# EAGLE design poeli (EAGLE 6.1)
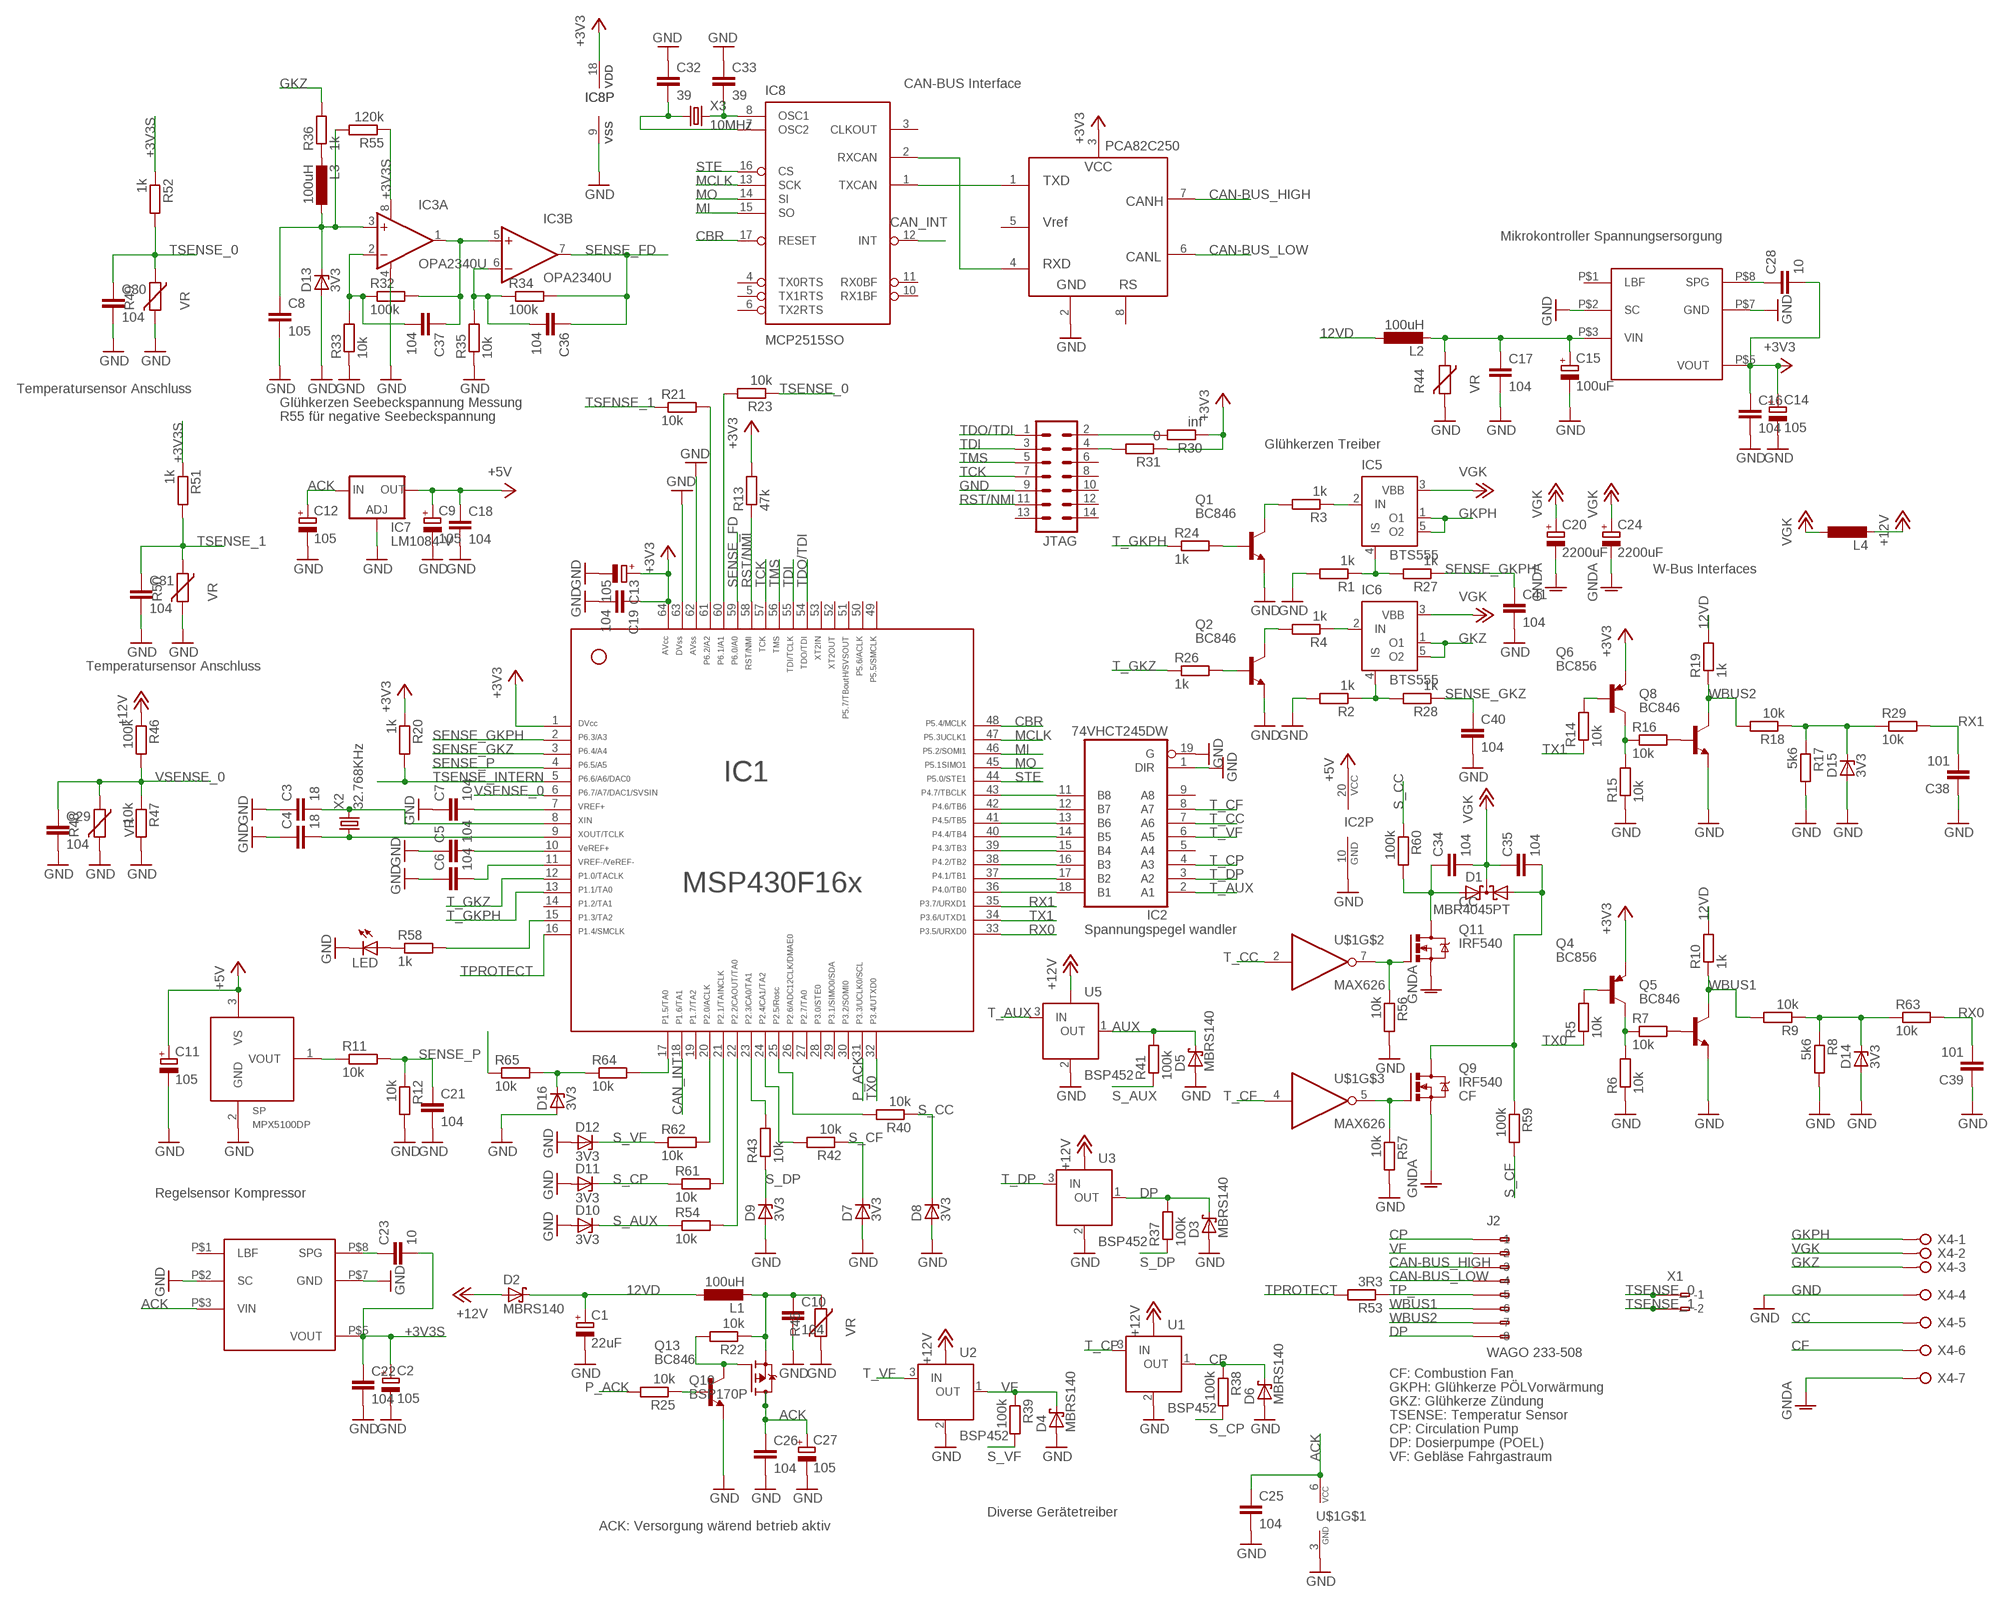
[diagram p0: schematic, sheet 1]

## Parts
C1  22uF  CPOL-EUC  [PANASONIC_C]
C2  105  CPOL-EUUD-4X5,8  [UD-4X5,8_NICHICON]
C3  18  C-EUC0603  [C0603]
C4  18  C-EUC0603  [C0603]
C5  104  C-EUC0603  [C0603]
C6  104  C-EUC0603  [C0603]
C7  104  C-EUC0603  [C0603]
C8  105  C-EUC1206  [C1206]
C9  105  CPOL-EUUD-4X5,8  [UD-4X5,8_NICHICON]
C10  104  C-EUC1206  [C1206]
C11  105  CPOL-EUUD-4X5,8  [UD-4X5,8_NICHICON]
C12  105  CPOL-EUUD-4X5,8  [UD-4X5,8_NICHICON]
C13  105  CPOL-EUUD-4X5,8  [UD-4X5,8_NICHICON]
C14  105  CPOL-EUUD-4X5,8  [UD-4X5,8_NICHICON]
C15  100uF  CPOL-EUUD-6,3X7,7  [UD-6,3X7,7_NICHICON]
C16  104  C-EUC0805K  [C0805K]
C17  104  C-EUC0805K  [C0805K]
C18  104  C-EUC1206  [C1206]
C19  104  C-EUC1206  [C1206]
C20  2200uF  CPOL-EUSANYO_G  [SANYO-OSCON_G]
C21  104  C-EUC0805K  [C0805K]
C22  104  C-EUC0603K  [C0603K]
C23  10  C-EUC0603  [C0603]
C24  2200uF  CPOL-EUSANYO_G  [SANYO-OSCON_G]
C25  104  C-EUC0805  [C0805]
C26  104  C-EUC1206  [C1206]
C27  105  CPOL-EUUD-4X5,8  [UD-4X5,8_NICHICON]
C28  10  C-EUC0603  [C0603]
C29  104  C-EUC0805K  [C0805K]
C30  104  C-EUC0805K  [C0805K]
C31  104  C-EUC0805K  [C0805K]
C32  39  C-EUC0603  [C0603]
C33  39  C-EUC0603  [C0603]
C34  104  C-EUC1206  [C1206]
C35  104  C-EUC1206  [C1206]
C36  104  C-EUC0603  [C0603]
C37  104  C-EUC0603  [C0603]
C38  101  C-EUC0402  [C0402]
C39  101  C-EUC0402  [C0402]
C40  104  C-EUC0603  [C0603]
C41  104  C-EUC0603  [C0603]
D1  MBR4045PT  DIODE_2SCHOTTKY-SOT93V  [SOT93S]
D2  MBRS140  MBRS130LT3  [SMB]
D3  MBRS140  MBRS130LT3  [SMB]
D4  MBRS140  MBRS130LT3  [SMB]
D5  MBRS140  MBRS130LT3  [SMB]
D6  MBRS140  MBRS130LT3  [SMB]
D7  3V3  ZENER-DIODESOD80C  [SOD80C]
D8  3V3  ZENER-DIODESOD80C  [SOD80C]
D9  3V3  ZENER-DIODESOD80C  [SOD80C]
D10  3V3  ZENER-DIODESOD80C  [SOD80C]
D11  3V3  ZENER-DIODESOD80C  [SOD80C]
D12  3V3  ZENER-DIODESOD80C  [SOD80C]
D13  3V3  ZENER-DIODESOD80C  [SOD80C]
D14  3V3  ZENER-DIODESOD80C  [SOD80C]
D15  3V3  ZENER-DIODESOD80C  [SOD80C]
D16  3V3  ZENER-DIODESOD80C  [SOD80C]
IC1  F169  F16X---PM64  [PM/PAG64]
IC2  74VHCT245DW  74LS245DW  [SO20W]
IC3  OPA2340U  [SO08]
IC4  ZLDO330  [SM08]
IC5  BTS555  [TO220-51]
IC6  BTS555  [TO220-51]
IC7  LM1084-V  [317TS]
IC8  MCP2515SO  MCP2510SO  [SO-18W]
IC9  PAC82C250  [PAC82C250]
IC10  ZLDO330  [SM08]
J2  WAGO 233-508  233-508  [233-508]
JTAG  MA07-2  [MA07-2]
L1  100uH  L-EUPIS2816  [PIS2816]
L2  100uH  L-EUL2825P  [L2825P]
L3  100uH  L-EUL2825P  [L2825P]
L4  L-EUL1812  [L1812]
LED  LEDCHIP-LED0603  [CHIP-LED0603]
Q1  BC846  BC846ALT1SMD  [SOT23]
Q2  BC846  BC846ALT1SMD  [SOT23]
Q4  BC856  BC856ALT1SMD  [SOT23-BEC]
Q5  BC846  BC846ALT1SMD  [SOT23]
Q6  BC856  BC856ALT1SMD  [SOT23-BEC]
Q8  BC846  BC846ALT1SMD  [SOT23]
Q9  IRF540  [TO220BV]
Q10  BSP170P  [SOT223]
Q11  IRF540  [TO220BV]
Q13  BC846  BC846ALT1SMD  [SOT23]
R1  1k  R-EU_R0603  [R0603]
R2  1k  R-EU_R0603  [R0603]
R3  1k  R-EU_R0603  [R0603]
R4  1k  R-EU_R0603  [R0603]
R5  10k  R-EU_R0603  [R0603]
R6  10k  R-EU_R0603  [R0603]
R7  10k  R-EU_R0603  [R0603]
R8  5k6  R-EU_R0603  [R0603]
R9  10k  R-EU_R0603  [R0603]
R10  1k  R-EU_R0603  [R0603]
R11  10k  R-EU_R0603  [R0603]
R12  10k  R-EU_R0603  [R0603]
R13  47k  R-EU_R0603  [R0603]
R14  10k  R-EU_R0603  [R0603]
R15  10k  R-EU_R0603  [R0603]
R16  10k  R-EU_R0603  [R0603]
R17  5k6  R-EU_R0603  [R0603]
R18  10k  R-EU_R0603  [R0603]
R19  1k  R-EU_R0603  [R0603]
R20  1k  R-EU_R0603  [R0603]
R21  10k  R-EU_R0603  [R0603]
R22  10k  R-EU_R0805  [R0805]
R23  10k  R-EU_R0603  [R0603]
R24  1k  R-EU_R0603  [R0603]
R25  10k  R-EU_R0603  [R0603]
R26  1k  R-EU_R0603  [R0603]
R27  1k  R-EU_R0603  [R0603]
R28  1k  R-EU_R0603  [R0603]
R29  10k  R-EU_R0603  [R0603]
R30  inf  R-EU_R0603  [R0603]
R31  0  R-EU_R0603  [R0603]
R32  100k  R-EU_R0603  [R0603]
R33  10k  R-EU_R0603  [R0603]
R34  100k  R-EU_R0603  [R0603]
R35  10k  R-EU_R0603  [R0603]
R36  1k  R-EU_R0603  [R0603]
R37  100k  R-EU_R0603  [R0603]
R38  100k  R-EU_R0603  [R0603]
R39  100k  R-EU_R0603  [R0603]
R40  10k  R-EU_R0603  [R0603]
R41  100k  R-EU_R0603  [R0603]
R42  10k  R-EU_R0603  [R0603]
R43  10k  R-EU_R0603  [R0603]
R44  VR  VARISTORCN1206  [CT/CN1206]
R45  VR  VARISTORCN1206  [CT/CN1206]
R46  100k  R-EU_R0805  [R0805]
R47  10k  R-EU_R0805  [R0805]
R48  VR  VARISTORCN0603  [CT/CN0603]
R49  VR  VARISTORCN0603  [CT/CN0603]
R50  VR  VARISTORCN0603  [CT/CN0603]
R51  1k  R-EU_R0603  [R0603]
R52  1k  R-EU_R0603  [R0603]
R53  3R3  R-EU_R0805  [R0805]
R54  10k  R-EU_R0603  [R0603]
R55  120k  R-EU_R1206  [R1206]
R56  10k  R-EU_R0805  [R0805]
R57  10k  R-EU_R0805  [R0805]
R58  1k  R-EU_R0603  [R0603]
R59  100k  R-EU_R0603  [R0603]
R60  100k  R-EU_R0603  [R0603]
R61  10k  R-EU_R0603  [R0603]
R62  10k  R-EU_R0603  [R0603]
R63  10k  R-EU_R0603  [R0603]
R64  10k  R-EU_R0603  [R0603]
R65  10k  R-EU_R0603  [R0603]
SP  MPX5100DP  [MPX5100DP]
U1  BSP452  [SOT223]
U2  BSP452  [SOT223]
U3  BSP452  [SOT223]
U5  BSP452  [SOT223]
U$1  MAX626  [SO08]
X1  233-502  [233-502]
X2  32.768KHz  CRYSTALTC26V  [TC26V]
X3  10MHz  CRYSTALCTS406  [CTS406]
X4  W237-07P  [W237-7P]

## Nets
12VD [GK]: C1.+ D2.C L1.1 L2.1 R10.2 R19.2
+3V3: C13.+ C14.+ C16.1 C19.1 C28.2 IC1.1 IC1.64 IC8.18(VDD) IC9.3(VCC) IC10.P$5(VOUT) Q4.E Q6.E R13.2 R20.1 R30.1 R31.1
+3V3S: C2.+ C22.1 C23.2 IC3.8(A:V+) IC4.P$5(VOUT) R51.1 R52.1 R55.1
+5V: C9.+ C11.+ C18.1 IC2.20(VCC) IC7.2(OUT) SP.3(VS)
+12V [GK]: D2.A L4.1 L4.2 R46.1 U1.4(VBB) U2.4(VBB) U3.4(VBB) U5.4(VBB) ; supply symbol labelled VGK
ACK [ACT]: C12.+ C25.1 C26.1 C27.+ IC4.P$3(VIN) IC7.3(IN) Q10.2(D) Q10.4(D1) U$1.6(VCC)
AUX: D5.C R41.2 U5.1(OUT)
CAF_RPS_INPUT: R65.1
CAN-BUS_HIGH: IC9.7(CANH) J2.A3(-3)
CAN-BUS_LOW: IC9.6(CANL) J2.A4(-4)
CAN_INT: IC1.18 IC8.12(INT)
CBR: IC1.48 IC8.17(RESET)
CC: C34.1 D1.A2 Q11.D R60.2 X4.5
CF: C35.2 D1.A1 Q9.D R59.1 X4.6
CP: D6.C J2.A1(-1) R38.1 U1.1(OUT)
DP [ACT]: D3.C J2.A8(-8) R37.2 U3.1(OUT)
GKPH [GK]: IC5.1(O1) IC5.5(O2) X4.1
GKZ [GK]: IC6.1(O1) IC6.5(O2) R36.2 X4.3
GND [GK]: C1.- C2.- C3.1 C4.1 C5.1 C6.1 C7.1 C8.2 C9.- C10.2 C11.- C12.- C13.- C14.- C15.- C16.2 C17.2 C18.2 C19.2 C21.2 C22.2 C25.2 C26.2 C27.- C29.2 C30.2 C31.2 C32.1 C33.1 C38.1 C39.1 C40.2 C41.2 D3.A D4.A D5.A D6.A D7.A D8.A D9.A D10.A D11.A D12.A D13.A D14.A D15.A D16.A IC1.62 IC1.63 IC2.1(DIR) IC2.10(GND) IC2.19(G) IC3.4(A:V-) IC4.P$2(SC) IC4.P$7(GND) IC7.1(ADJ) IC8.9(VSS) IC9.2(GND) IC10.P$2(SC) IC10.P$7(GND) JTAG.9 LED.C Q1.2(E) Q2.2(E) Q5.2(E) Q8.2(E) Q13.2(E) R1.2 R2.2 R6.1 R8.2 R12.2 R15.1 R17.2 R33.1 R35.1 R44.2 R45.2 R47.2 R48.2 R49.2 R50.2 R56.2 R57.2 SP.2(GND) U1.2(GND) U2.2(GND) U3.2(GND) U5.2(GND) U$1.3(GND) X4.4
GNDA [GK]: C20.- C24.- Q9.S Q11.S X4.7
MCLK: IC1.47 IC8.13(SCK)
MI: IC1.46 IC8.15(SO)
MO: IC1.45 IC8.14(SI)
N$1: IC8.1(TXCAN) IC9.1(TXD)
N$2: IC6.4(IS) R2.1 R28.2
N$3: Q1.3(C) R3.2
N$4: Q2.3(C) R4.2
N$5: IC1.43 IC2.11(B8)
N$6: IC5.2(IN) R3.1
N$7: C4.2 IC1.9 X2.1
N$8: JTAG.2 R30.2
N$9: JTAG.4 R31.2
N$10: IC5.4(IS) R1.1 R27.2
N$11: IC1.42 IC2.12(B7)
N$12: IC1.41 IC2.13(B6)
N$13: IC1.40 IC2.14(B5)
N$14: Q2.1(B) R26.2
N$15: IC6.2(IN) R4.1
N$16: Q1.1(B) R24.2
N$17: Q4.B R5.2
N$18: R11.1 SP.1(VOUT)
N$19: Q4.C R6.2 R7.1
N$20: Q5.1(B) R7.2
N$21: C23.1 IC4.P$8(SPG)
N$22: D14.C R8.1 R9.1 R63.1
N$23: IC1.39 IC2.15(B4)
N$24: IC1.38 IC2.16(B3)
N$25: LED.A R58.1
N$26: C3.2 IC1.8 X2.2
N$27: Q6.B R14.2
N$28: Q6.C R15.2 R16.1
N$29: C5.2 IC1.10
N$30: C6.2 IC1.11
N$31: C7.2 IC1.7
N$32: IC1.17 R64.2
N$33: Q8.1(B) R16.2
N$34: IC1.37 IC2.17(B2)
N$35: C36.2 IC3.6(B:-IN) R34.1 R35.2
N$36: IC1.36 IC2.18(B1)
N$37: Q11.G R56.1 U$1.7(O)
N$38: Q9.G R57.1 U$1.5(O)
N$39: Q13.1(B) R25.1
N$40: C37.2 IC3.2(A:-IN) R32.1 R33.2
N$41: C8.1 D13.C IC3.3(A:+IN) L3.1 R55.2
N$42: Q10.1(G) Q13.3(C) R22.2
N$43: C37.1 IC3.1(A:OUT) IC3.5(B:+IN) R32.2
N$44: L3.2 R36.1
N$45: IC1.61 R21.2
N$46: IC1.60 R23.2
N$47: IC1.25 R40.2
N$48: IC8.2(RXCAN) IC9.4(RXD)
N$49: C33.2 IC8.8(OSC1) X3.3
N$50: IC1.24 R42.2
N$51: IC1.23 R43.2
N$52: IC1.22 R54.2
N$53: IC1.21 R61.2
N$54: IC1.20 R62.2
N$55: D16.C R64.1 R65.2
N$57: C28.1 IC10.P$8(SPG)
N$58: C10.1 L1.2 Q10.3(S) R22.1 R45.1
N$59: C15.+ C17.1 IC10.P$3(VIN) L2.2 R44.1
N$60: C32.2 IC8.7(OSC2) X3.1
N$69: IC1.15 R58.2
NET$22: D15.C R17.1 R18.1 R29.1
P_ACK: IC1.31 R25.2
RST/NMI: IC1.58 JTAG.11 R13.1
RX0: C39.2 IC1.33 R63.2
RX1: C38.2 IC1.35 R29.2
S_AUX: D10.C R41.1 R54.1
S_CC: D8.C R40.1 R60.1
S_CF: D7.C R42.1 R59.2
S_CP: D11.C R38.2 R61.1
S_DP: D9.C R37.1 R43.1
S_VF: D12.C R39.2 R62.1
SENSE_FD: C36.1 IC1.59 IC3.7(B:OUT) R34.2
SENSE_GKPH: C41.1 IC1.2 R27.1
SENSE_GKZ: C40.1 IC1.3 R28.1
SENSE_P: C21.1 IC1.4 R11.2 R12.1
STE: IC1.44 IC8.16(CS)
T_AUX: IC2.2(A1) U5.3(IN)
T_CC: IC2.7(A6) U$1.2(I)
T_CF: IC2.8(A7) U$1.4(I)
T_CP: IC2.4(A3) U1.3(IN)
T_DP: IC2.3(A2) U3.3(IN)
T_GKPH: IC1.13 R24.1
T_GKZ: IC1.12 R26.1
T_VF: IC2.6(A5) U2.3(IN)
TCK: IC1.57 JTAG.7
TDI: IC1.55 JTAG.3
TDO/TDI: IC1.54 JTAG.1
TMS: IC1.56 JTAG.5
TP_: J2.A5(-5) R53.1
TPROTECT: IC1.16 R53.2
TSENSE_0: C30.1 R23.1 R49.1 R52.2 X1.A1(-1) X1.B1(B-1)
TSENSE_1: C31.1 R21.1 R50.1 R51.2 X1.A2(-2) X1.B2(B-2)
TSENSE_INTERN: IC1.5 R20.2
TX0: IC1.32 R5.1
TX1: IC1.34 R14.1
VF [ACT]: D4.C J2.A2(-2) R39.1 U2.1(OUT)
VGK [GK]: C20.+ C24.+ C34.2 C35.1 D1.C IC5.3(VBB) IC6.3(VBB) X4.2
VSENSE_0: C29.1 IC1.6 R46.2 R47.1 R48.1
WBUS1: J2.A6(-6) Q5.3(C) R9.2 R10.1
WBUS2: J2.A7(-7) Q8.3(C) R18.2 R19.1
Unconnected: IC1.14 IC1.19 IC1.26 IC1.27 IC1.28 IC1.29 IC1.30 IC1.49 IC1.50 IC1.51 IC1.52 IC1.53 IC2.5(A4) IC2.9(A8) IC4.P$1(LBF) IC8.3(CLKOUT) IC8.4(TX0RTS) IC8.5(TX1RTS) IC8.6(TX2RTS) IC8.10(RX1BF) IC8.11(RX0BF) IC9.5(VREF) IC9.8(RS) IC10.P$1(LBF) J2.B1(B-1) J2.B2(B-2) J2.B3(B-3) J2.B4(B-4) J2.B5(B-5) J2.B6(B-6) J2.B7(B-7) J2.B8(B-8) JTAG.6 JTAG.8 JTAG.10 JTAG.12 JTAG.13 JTAG.14 SP.4(V1) SP.5(V2) SP.6(VEX)

## Notes on the sheet
- CAN-BUS Interface
- Mikrokontroller Spannungsersorgung
- Temperatursensor Anschluss
- Glühkerzen Seebeckspannung Messung
- R55 für negative Seebeckspannung
- Glühkerzen Treiber
- W-Bus Interfaces
- Temperatursensor Anschluss
- Spannungspegel wandler
- Regelsensor Kompressor
- CF: Combustion Fan
- GKPH: Glühkerze PÖLVorwärmung
- GKZ: Glühkerze Zündung
- TSENSE: Temperatur Sensor
- CP: Circulation Pump
- DP: Dosierpumpe (POEL)
- VF: Gebläse Fahrgastraum
- Diverse Gerätetreiber
- ACK: Versorgung wärend betrieb aktiv

## Library data of the parts
C1 C2 C9 C11-C15 C20 C24 C27 = rcl:CPOL-EU: POLARIZED CAPACITOR, European symbol
C3-C8 C10 C16-C19 C21-C23 C25 C26 C28-C41 = rcl:C-EU: CAPACITOR, European symbol
D1 = diode:DIODE_2SCHOTTKY-: Dual SCHOTTKY DIODE common cathode
D2-D6 = diode:MBRS130LT3: Schottky Power Rectifier Source: http://www.onsemi.com/pub/Collateral/MBRS130LT3-D.PDF
D7-D16 = diode:ZENER-DIODE: Z-Diode
IC1 = TI_MSP430_v13:F16X---PM64: *** MSP430F16x *** PM64
IC2 = 74xx-us:74*245: Octal BUS TRANSCEIVER, 3-state
IC3 = burr-brown:OPA2340: Single-Supply, Rail-to-Rail Operational Amplifiers MicroAmplifier(TM) Series; Product Folder:OPA2340
IC4 IC10 = misc:ZLDO330
IC5 IC6 = infineon:BTS555: PROFET® Data Sheet BTS555 Source: http://www.infineon.com/upload/Document/cmc_upload/documents/011/8726/Datasheet_BTS555.pdf
IC7 = v-reg-2:LM1084: VOLTAGE REGULATOR
IC8 = microchip_can:MCP2510
IC9 = pca82c250:PAC82C250
J2 = con-wago:233-508: WAGO Cage Clamp
JTAG = con-lstb:MA07-2: PIN HEADER
L1-L4 = rcl:L-EU: INDUCTOR, European symbol
LED = led:LED: LED OSRAM: - CHIPLED LG R971, LG N971, LY N971, LG Q971, LY Q971, LO R971, LY R971 LH N974, LH R974 LS Q976, LO Q976, LY Q976 LO Q996 - Hyper CHIPLED LW Q18S LB Q993, LB Q99A, LB R99A - SideLED LS A670, LO A670, LY A670, LG A670, LP A670 LB A673, LV A673, LT A673, LW A673 LH A674 LY A675 LS A676, LA A676, LO A676, LY A676, LW A676 LS A679, LY A679, LG A679 - Hyper Micro SIDELED® LS Y876, LA Y876, LO Y876, LY Y876 LT Y87S - SmartLED LW L88C, LW L88S LB L89C, LB L89S, LG L890 LS L89K, LO L89K, LY L89K LS L896, LA L896, LO L896, LY L896 - TOPLED LS T670, LO T670, LY T670, LG T670, LP T670 LSG T670, LSP T670, LSY T670, LOP T670, LYG T670 LG T671, LOG T671, LSG T671 LB T673, LV T673, LT T673, LW T673 LH T674 LS T676, LA T676, LO T676, LY T676, LB T676, LH T676, LSB T676, LW T676 LB T67C, LV T67C, LT T67C, LS T67K, LO T67K, LY T67K, LW E67C LS E67B, LA E67B, LO E67B, LY E67B, LB E67C, LV E67C, LT E67C LW T67C LS T679, LY T679, LG T679 LS T770, LO T770, LY T770, LG T770, LP T770 LB T773, LV T773, LT T773, LW T773 LH T774 LS E675, LA E675, LY E675, LS T675 LS T776, LA T776, LO T776, LY T776, LB T776 LHGB T686 LT T68C, LB T68C - Hyper Mini TOPLED® LB M676 - Mini TOPLED Santana® LG M470 LS M47K, LO M47K, LY M47K Source: http://www.osram.convergy.de LUXEON: - LUMILED® LXK2-PW12-R00, LXK2-PW12-S00, LXK2-PW14-U00, LXK2-PW14-V00 LXK2-PM12-R00, LXK2-PM12-S00, LXK2-PM14-U00 LXK2-PE12-Q00, LXK2-PE12-R00, LXK2-PE12-S00, LXK2-PE14-T00, LXK2-PE14-U00 LXK2-PB12-K00, LXK2-PB12-L00, LXK2-PB12-M00, LXK2-PB14-N00, LXK2-PB14-P00, LXK2-PB14-Q00 LXK2-PR12-L00, LXK2-PR12-M00, LXK2-PR14-Q00, LXK2-PR14-R00 LXK2-PD12-Q00, LXK2-PD12-R00, LXK2-PD12-S00 LXK2-PH12-R00, LXK2-PH12-S00 LXK2-PL12-P00, LXK2-PL12-Q00, LXK2-PL12-R00 Source: www.luxeon.com KINGBRIGHT: KA-3528ASYC Source: www.kingbright.com
Q1 Q2 Q5 Q8 Q13 = transistor-npn:BC846*: NPN Transistor
Q4 Q6 = transistor-pnp:BC856*: PNP Transistror
Q9 Q11 = transistor-power:IRF540: HEXFET Power MOSFET
Q10 = transistor-fet:BSP170P: SIPMOS(R) Small-Signal-Transistor P-Channel, Enhancement mode Source: http://www.infineon.com/upload/Document/BSP170P_Rev2.4.pdf
R1-R43 R46 R47 R51-R65 = rcl:R-EU_: RESISTOR, European symbol
R44 R45 R48-R50 = varistor:VARISTOR: VARISTOR
SP = mpx4100a:MPX5100: Freescale Pressure sensor
U1-U3 U5 = infineon:BSP452
U$1 = maxim:MAX626: Dual MOS-FET inverting driver
X1 = con-wago:233-502: WAGO Cage Clamp; MPN: 233-502; OC_FARNELL: 1777096; OC_NEWARK: 58M2630
X2 X3 = crystal:CRYSTAL: CRYSTAL
X4 = con-wago-508:W237-07P: WAGO SREW CLAMP; OC_FARNELL: unknown; OC_NEWARK: unknown

## Net classes
1 GK: width 1.27 mm, clearance 0.254 mm
2 ACT: width 0.61 mm, clearance 0.254 mm

## Board
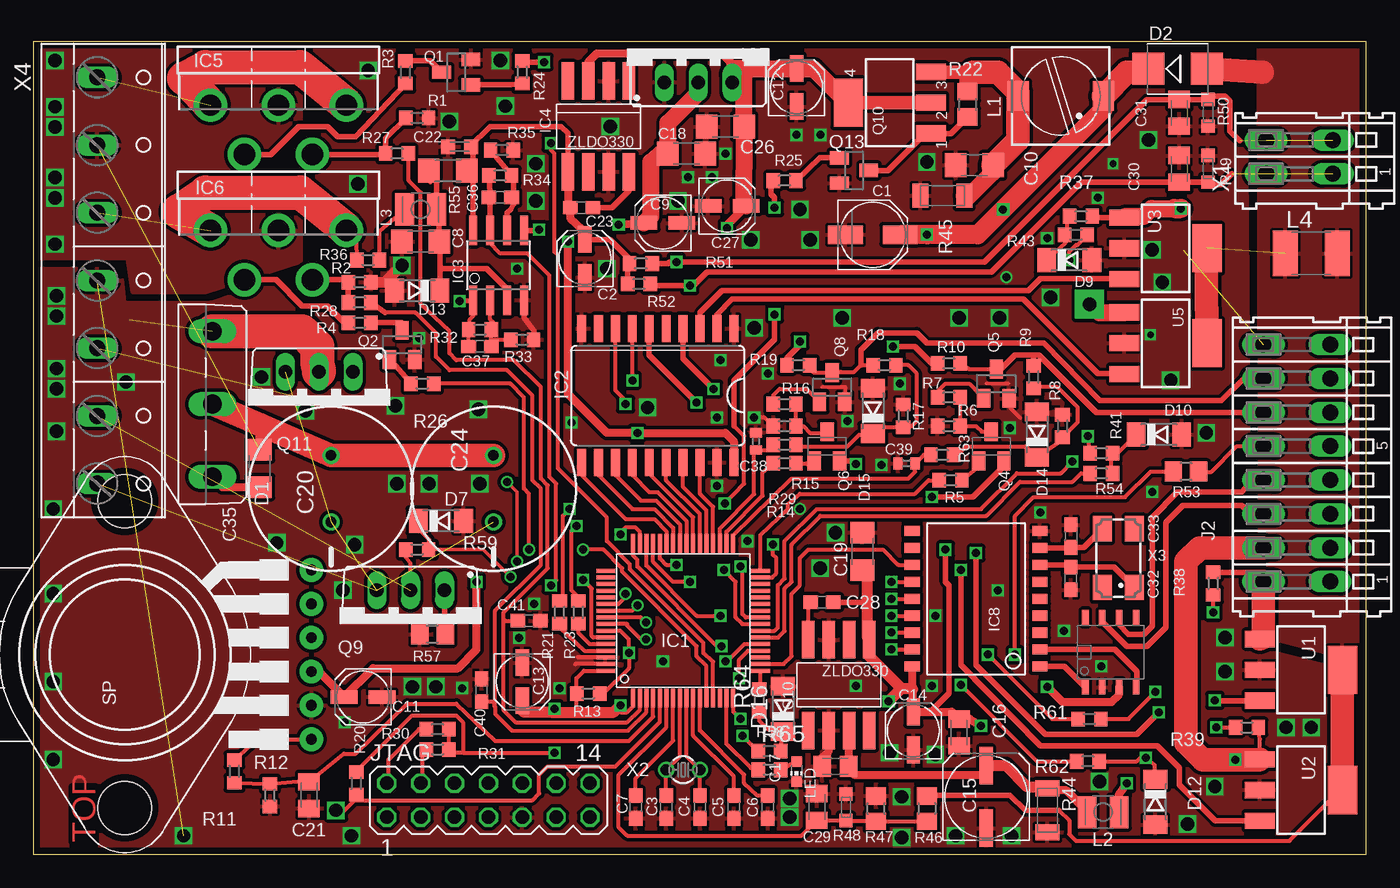
[diagram p1: board, top side]
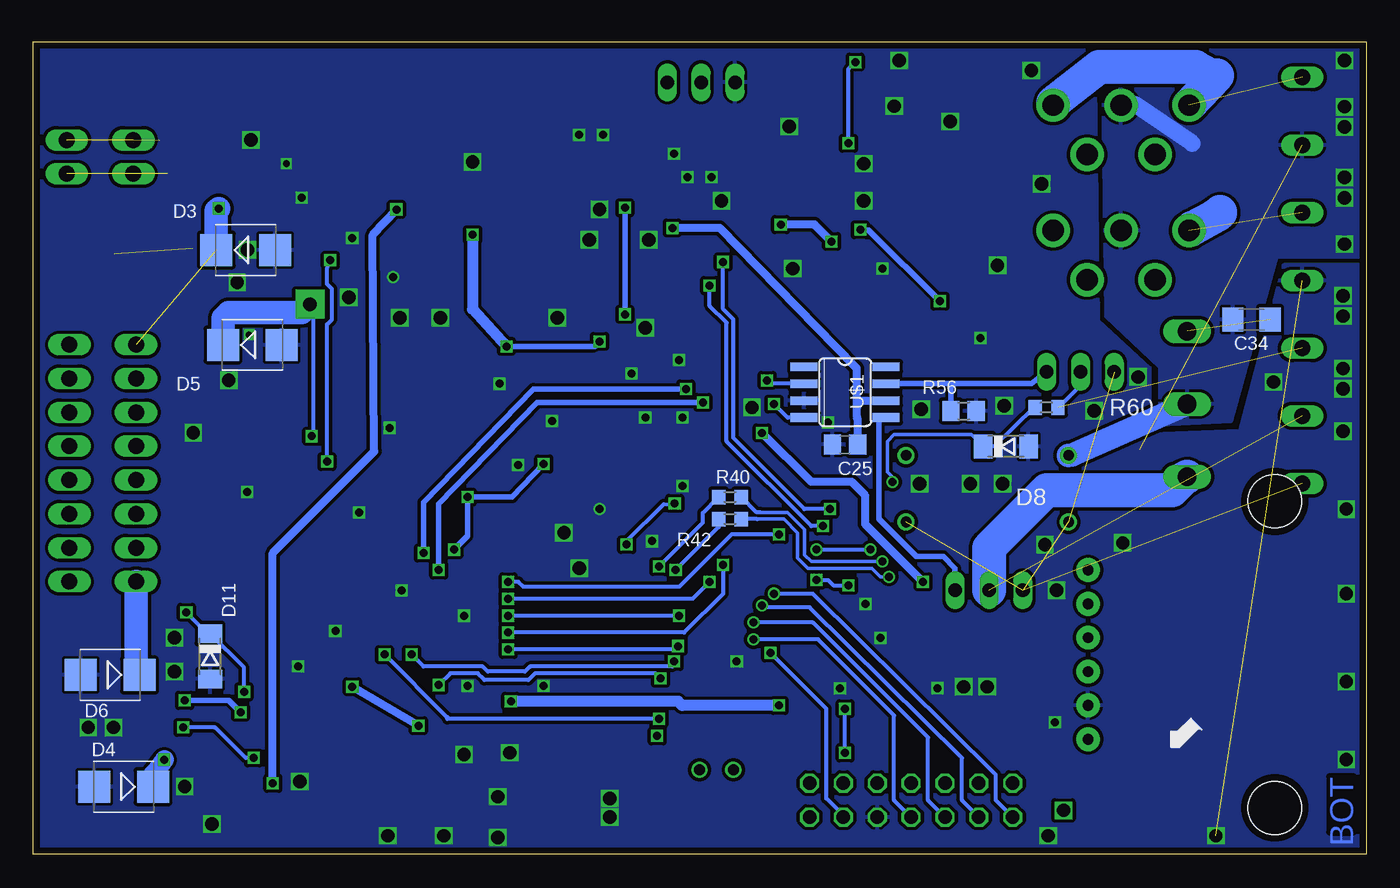
[diagram p2: board, bottom side, seen from below]

Size 99.97 x 60.95 mm. Coordinates in mm from the lower left corner, seen from the top.
Outline: 0,0 99.97,0 99.97,60.95 0,60.95 0,0
Copper layers (1*16): Top 0.035mm / dielectric 1.5mm / Bottom 0.035mm
Design rules: minimum track width 8mil, minimum drill 0.3mm, track to track 8mil, track to pad 8mil, pad to pad 8mil, via to via 8mil, smd to smd 8mil, copper to edge 20mil, drill to drill 10mil, minimum pad ring 8mil, minimum via ring 6mil, stop-mask expansion 3mil, vias tented up to drill 0mil, thermal gap 8mil

### Footprints (pad centres in the part's own frame; a part is rotated, then mirrored left to right if it is on the bottom)
PANASONIC_C = smd 2.6 x 1.4: + 2.05,0; - -2.05,0
UD-4X5,8_NICHICON = smd 2 x 1: + 1.425,0; - -1.425,0
C0603 = smd 1.1 x 1: 1 -0.85,0; 2 0.85,0
C1206 = smd 1.6 x 1.8: 1 -1.4,0; 2 1.4,0
UD-6,3X7,7_NICHICON = smd 2.8 x 1: + 2.35,0; - -2.35,0
C0805K = smd 1.3 x 1.6: 1 -1,0; 2 1,0
SANYO-OSCON_G = drill 0.8 pad 1.27: + 2.5,0; - -2.5,0
C0603K = smd 1.05 x 1.08: 1 -0.875,0; 2 0.875,0
C0805 = smd 1.3 x 1.5: 1 -0.95,0; 2 0.95,0
C0402 = smd 0.7 x 0.9: 1 -0.65,0; 2 0.65,0
SOT93S = drill 1.397 long: A1 -5.461,-2.54; A2 5.461,-2.54; C 0,-2.54
SMB = smd 2.4 x 2.4: A 2.2,0; C -2.2,0
SOD80C = smd 1.4 x 1.8: A 1.7,0; C -1.7,0
PM/PAG64 = smd 1.4 x 0.3: 1 -5.8,3.75; 2 -5.8,3.25; 3 -5.8,2.75; 4 -5.8,2.25; 5 -5.8,1.75; 6 -5.8,1.25; 7 -5.8,0.75; 8 -5.8,0.25; 9 -5.8,-0.25; 10 -5.8,-0.75; 11 -5.8,-1.25; 12 -5.8,-1.75; 13 -5.8,-2.25; 14 -5.8,-2.75; 15 -5.8,-3.25; 16 -5.8,-3.75; 33 5.8,-3.75; 34 5.8,-3.25; 35 5.8,-2.75; 36 5.8,-2.25; 37 5.8,-1.75; 38 5.8,-1.25; 39 5.8,-0.75; 40 5.8,-0.25; 41 5.8,0.25; 42 5.8,0.75; 43 5.8,1.25; 44 5.8,1.75; 45 5.8,2.25; 46 5.8,2.75; 47 5.8,3.25; 48 5.8,3.75 | smd 0.3 x 1.4: 17 -3.75,-5.8; 18 -3.25,-5.8; 19 -2.75,-5.8; 20 -2.25,-5.8; 21 -1.75,-5.8; 22 -1.25,-5.8; 23 -0.75,-5.8; 24 -0.25,-5.8; 25 0.25,-5.8; 26 0.75,-5.8; 27 1.25,-5.8; 28 1.75,-5.8; 29 2.25,-5.8; 30 2.75,-5.8; 31 3.25,-5.8; 32 3.75,-5.8; 49 3.75,5.8; 50 3.25,5.8; 51 2.75,5.8; 52 2.25,5.8; 53 1.75,5.8; 54 1.25,5.8; 55 0.75,5.8; 56 0.25,5.8; 57 -0.25,5.8; 58 -0.75,5.8; 59 -1.25,5.8; 60 -1.75,5.8; 61 -2.25,5.8; 62 -2.75,5.8; 63 -3.25,5.8; 64 -3.75,5.8
SO20W = smd 0.66 x 2.032: 1 -5.715,-5.029; 2 -4.445,-5.029; 3 -3.175,-5.029; 4 -1.905,-5.029; 5 -0.635,-5.029; 6 0.635,-5.029; 7 1.905,-5.029; 8 3.175,-5.029; 9 4.445,-5.029; 10 5.715,-5.029; 11 5.715,5.029; 12 4.445,5.029; 13 3.175,5.029; 14 1.905,5.029; 15 0.635,5.029; 16 -0.635,5.029; 17 -1.905,5.029; 18 -3.175,5.029; 19 -4.445,5.029; 20 -5.715,5.029
SO08 = smd 0.61 x 2.21: 1 -1.905,-2.616; 2 -0.635,-2.616; 3 0.635,-2.616; 4 1.905,-2.616; 5 1.905,2.616; 6 0.635,2.616; 7 -0.635,2.616; 8 -1.905,2.616
SM08 = smd 0.94 x 2.794: P$1 -2.286,-3.404; P$2 -0.762,-3.404; P$3 0.762,-3.404; P$4 2.286,-3.404; P$5 2.286,3.404; P$6 0.762,3.404; P$7 -0.762,3.404; P$8 -2.286,3.404
TO220-51 = drill 1.6 pad 2.5: 1 -5.1,-4.5; 2 -2.55,-8.2; 3 0,-4.5; 4 2.55,-8.2; 5 5.1,-4.5
317TS = drill 1.016 long: 1 -2.54,-2.54; 2 0,-2.54; 3 2.54,-2.54
SO-18W = smd 0.762 x 1.143: 1 -5.08,-4.788; 2 -3.81,-4.788; 3 -2.54,-4.788; 4 -1.27,-4.788; 5 0,-4.788; 6 1.27,-4.788; 7 2.54,-4.788; 8 3.81,-4.788; 9 5.08,-4.788; 10 5.08,4.788; 11 3.81,4.788; 12 2.54,4.788; 13 1.27,4.788; 14 0,4.788; 15 -1.27,4.788; 16 -2.54,4.788; 17 -3.81,4.788; 18 -5.08,4.788
PAC82C250 = smd 0.5 x 1.1: 1 -1.71,-2.57; 2 -0.44,-2.57; 3 0.83,-2.57; 4 2.1,-2.57; 5 2.1,2.67; 6 0.83,2.67; 7 -0.44,2.67; 8 -1.71,2.67
233-508 = drill 1.2 long: A1 -8.89,2.5; A2 -6.35,2.5; A3 -3.81,2.5; A4 -1.27,2.5; A5 1.27,2.5; A6 3.81,2.5; A7 6.35,2.5; A8 8.89,2.5; B1 -8.89,-2.5; B2 -6.35,-2.5; B3 -3.81,-2.5; B4 -1.27,-2.5; B5 1.27,-2.5; B6 3.81,-2.5; B7 6.35,-2.5; B8 8.89,-2.5
MA07-2 = drill 1.016 octagon: 1 -7.62,-1.27; 2 -7.62,1.27; 3 -5.08,-1.27; 4 -5.08,1.27; 5 -2.54,-1.27; 6 -2.54,1.27; 7 0,-1.27; 8 0,1.27; 9 2.54,-1.27; 10 2.54,1.27; 11 5.08,-1.27; 12 5.08,1.27; 13 7.62,-1.27; 14 7.62,1.27
PIS2816 = smd 2.2 x 1.6: 1 0,3.2; 2 0,-3.2
L2825P = smd 1.4 x 2.4: 1 -1.2,0; 2 1.2,0
L1812 = smd 1.9 x 3.4: 1 -1.95,0; 2 1.95,0
CHIP-LED0603 = smd 0.8 x 0.8: A 0,-0.75; C 0,0.75
SOT23 = smd 1 x 1.4: 1 -0.95,-1.1; 2 0.95,-1.1; 3 0,1.1
SOT23-BEC = smd 1 x 1.4: B -0.95,-1.1; C 0,1.1; E 0.95,-1.1
TO220BV = drill 1.016 long: D 0,-2.54; G -2.54,-2.54; S 2.54,-2.54
SOT223 = smd 1.219 x 2.235: 1 -2.311,-3.099; 2 0,-3.099; 3 2.311,-3.099 | smd 3.6 x 2.2: 4 0,3.099
R0603 = smd 1 x 1.1: 1 -0.85,0; 2 0.85,0
R0805 = smd 1.3 x 1.5: 1 -0.95,0; 2 0.95,0
CT/CN1206 = smd 1.2 x 1.8: 1 -1.65,0; 2 1.65,0
CT/CN0603 = smd 1 x 1: 1 -1,0; 2 1,0
R1206 = smd 1.6 x 1.803: 1 -1.422,0; 2 1.422,0
MPX5100DP = drill 0.8 pad 1.778: 1 -6.35,-13.995; 2 -3.81,-14; 3 -1.27,-14; 4 1.27,-14; 5 3.81,-14; 6 6.35,-13.995 | hole 4: -11.5,0; 11.5,0
SO08' = smd 0.66 x 2.032: 1 -1.905,-3.073; 2 -0.635,-3.073; 3 0.635,-3.073; 4 1.905,-3.073; 5 1.905,3.073; 6 0.635,3.073; 7 -0.635,3.073; 8 -1.905,3.073
233-502 = drill 1.2 long: A1 -1.27,2.5; A2 1.27,2.5; B1 -1.27,-2.5; B2 1.27,-2.5
TC26V = drill 0.813: 1 -1.27,0; 2 1.27,0
CTS406 = smd 1.9 x 1.4: 1 -2.2,-1.2; 2 2.2,-1.2; 3 2.2,1.2; 4 -2.2,1.2
W237-7P = drill 1.194 long: 1 -15.24,-0.635; 2 -10.16,-0.635; 3 -5.08,-0.635; 4 0,-0.635; 5 5.08,-0.635; 6 10.16,-0.635; 7 15.24,-0.635

### Placement (x,y rotation side)
C1  62.96,46.48 0 top
C2  41.37,44.7 90 top
C3  47.47,3.56 90 top
C4  50.01,3.56 90 top
C5  52.55,3.56 90 top
C6  55.09,3.56 90 top
C7  45.18,3.56 90 top
C8  29.05,45.97 180 top
C9  47.21,47.37 180 top
C10  70.58,51.69 180 top
C11  24.73,11.81 180 top
C12  57.25,57.53 90 top
C13  36.67,12.95 270 top
C14  66.01,9.27 90 top
C15  71.47,4.32 90 top
C16  69.44,9.14 270 top
C17  60.17,6.6 180 top
C18  48.99,52.58 0 top
C19  62.2,22.73 90 top
C20  22.32,27.43 90 top
C21  20.67,4.45 270 top
C22  31.97,53.09 180 top
C23  41.12,48.51 180 top
C24  34.51,27.43 90 top
C25  39.08,30.73 180 bottom
C26  51.91,54.61 180 top
C27  52.04,48.64 0 top
C28  59.15,18.92 0 top
C29  58.77,3.56 90 top
C30  85.95,51.44 90 top
C31  85.95,55.63 270 top
C32  77.82,20.7 90 top
C33  77.82,23.88 270 top
C34  8.6,40.13 180 bottom
C35  16.99,28.96 270 top
C36  35.02,49.28 0 top
C37  33.5,38.1 0 top
C38  54.2,30.99 270 top
C39  65.5,29.34 0 top
C40  33.62,12.32 90 top
C41  37.18,17.53 0 top
D1  10.89,33.78 90 top
D2  85.82,58.93 0 top
D3  84.04,45.34 0 bottom
D4  93.19,5.08 180 bottom
D5  83.53,38.23 0 bottom
D6  94.2,13.46 180 bottom
D7  30.57,25.02 0 top
D8  27.02,30.61 0 bottom
D9  77.69,44.58 0 top
D10  84.42,31.5 0 top
D11  86.71,14.86 270 bottom
D12  84.17,3.94 270 top
D13  28.8,42.29 180 top
D14  75.28,31.5 90 top
D15  62.96,33.27 90 top
D16  56.23,10.92 90 top
IC1  48.74,17.53 90 top
IC2  46.83,34.42 180 top
IC3  34.89,44.2 0 top
IC4  42.39,54.61 180 top
IC5  18.38,60.71 0 top
IC6  18.38,51.31 0 top
IC7  49.88,60.45 0 top
IC8  70.71,19.18 90 top
IC9  80.61,15.11 0 top
IC10  60.42,12.7 0 top
J2  94.76,29.36 90 top
JTAG  34.13,4.06 0 top
L1  77.06,56.9 270 top
L2  80.23,3.17 180 top
L3  29.05,48.39 180 top
L4  95.85,45.09 0 top
LED  57.25,6.22 180 top
Q1  31.72,58.67 90 top
Q2  27.65,38.23 0 top
Q4  71.85,30.61 0 top
Q5  72.23,35.31 0 top
Q6  59.53,30.61 0 top
Q8  59.91,35.05 0 top
Q9  28.29,17.27 180 top
Q10  64.23,56.39 90 top
Q11  21.43,33.66 180 top
Q13  61.56,51.31 270 top
R1  28.8,55.24 0 top
R2  24.48,42.93 0 top
R3  27.91,58.67 90 top
R4  24.48,39.88 0 top
R5  68.8,28.07 0 top
R6  68.67,32.13 0 top
R7  68.67,34.29 180 top
R8  77.18,32.13 90 top
R9  75.03,35.81 90 top
R10  68.67,36.83 180 top
R11  15.08,6.22 270 top
R12  17.75,4.45 270 top
R13  41.62,12.06 180 top
R14  56.36,29.34 0 top
R15  56.36,32.13 0 top
R16  56.36,33.78 180 top
R17  65.25,32.89 90 top
R18  63.85,36.7 180 top
R19  57.37,36.7 180 top
R20  24.23,5.33 270 top
R21  39.47,18.16 270 top
R22  70.07,56.26 270 top
R23  40.86,18.16 270 top
R24  36.67,58.67 270 top
R25  56.36,50.55 180 top
R26  29.18,35.31 180 top
R27  27.27,52.58 180 top
R28  24.48,41.4 180 top
R29  56.36,30.73 180 top
R30  30.32,9.4 180 top
R31  30.32,7.87 180 top
R32  33.5,39.37 180 top
R33  36.67,38.61 180 top
R34  35.02,50.93 180 top
R35  35.15,52.83 180 top
R36  25.11,44.58 180 top
R37  78.58,47.88 0 top
R38  88.49,20.32 270 top
R39  91.03,9.53 180 top
R40  47.72,26.8 180 bottom
R41  80.11,30.1 180 top
R42  47.72,25.15 180 bottom
R43  78.2,46.48 0 top
R44  76.04,3.3 270 top
R45  68.17,49.4 180 top
R46  67.02,3.43 270 top
R47  63.21,3.43 90 top
R48  60.95,3.53 90 top
R49  88.11,51.44 90 top
R50  88.11,55.63 270 top
R51  45.56,44.32 0 top
R52  45.43,42.8 0 top
R53  86.46,28.72 180 top
R54  80.11,28.57 180 top
R55  31.08,51.31 180 top
R56  30.19,33.27 0 bottom
R57  29.94,16.51 180 top
R58  55.21,6.35 180 top
R59  28.8,22.86 0 top
R60  23.97,33.53 0 bottom
R61  79.22,10.16 180 top
R62  79.09,6.99 180 top
R63  68.17,29.97 180 top
R64  54.45,11.56 90 top
R65  55.21,7.75 0 top
SP  6.86,14.99 90 top
U1  95.09,13.84 270 top
U2  95.09,4.83 270 top
U3  84.93,45.47 270 top
U5  84.93,38.35 270 top
U$1  MAX626  [SO08']  39.08,34.67 270 bottom
X1  94.96,52.32 90 top
X2  48.74,6.35 180 top
X3  81.38,22.23 90 top
X4  5.43,43.05 270 top

### Tracks (layer width: path | path; a pad name or v marks a point on that pad's centre or on a via)
12VD  (via drill 0.6)
  Top 0.406: v57.5,38.48 57.5,38.23 56.52,37.25 R19.2 | R10.2 67.41,36.83 66.14,38.1 v64.48,38.1
  Top 0.61: L2.1 81.43,4.5 v82.01,5.33
  Top 1.27: 83.05,58.67 D2.C
  Top 1.422: C1.+ v67.02,46.48 70.83,46.48 v72.74,48.39 80.23,55.88 80.23,56.87 L1.1
  Top 1.778: L1.1 82.03,58.67 83.05,58.67
  Bottom 0.406: v64.48,38.1 57.88,38.1 v57.5,38.48
  Bottom 0.61: v82.01,5.33 82.01,22.61 74.39,30.23 74.52,46.48 v72.74,48.39
  Bottom 0.813: v67.02,46.48 67.02,40.89 v64.48,38.1
+3V3  (via drill 0.6)
  Top 0.305: Q6.E 60.74,29.16 | IC1.64 41.3,13.78 40.74,13.21 40.74,12.1 | 40.74,12.1 R13.2 | IC1.1 44.99,11.11 44.55,10.67 44.04,10.67 43.78,10.92 | 40.74,10.67 40.74,12.1 | 60.04,18.88 C28.2 | v39.08,10.92 38.83,10.67 | 32.23,7.62 31.43,7.62 R31.1 R30.1 31.21,9.69 | 32.23,7.62 v39.08,7.62 | R20.1 24.23,6.22 28.42,10.41 31.72,10.41 32.23,9.91 32.23,7.62
  Top 0.406: v67.41,26.8 70.45,26.8 72.99,29.34 72.82,29.51 Q4.E | v68.42,22.86 68.42,20.45 68.67,20.19 68.67,12.06 67.41,10.79 67.41,10.82 67.28,10.7 | Q6.E 61.47,29.51 v61.69,29.29 | 60.04,18.88 62.49,18.88 62.49,18.96 62.58,19.05 | IC10.P$5 62.58,16.23
  Top 0.61: v71.09,9.65 70.22,10.18 69.47,10.18 C16.1 68.89,10.7 67.28,10.7 C14.+ | IC9.3 81.44,12.01 80.87,11.43 77.18,11.43 v76.04,12.57 | C14.+ 65.85,10.29 | IC8.18 65.92,12.32 65.92,10.79 C14.+
  Top 0.813: v44.04,11.18 43.78,10.92 43.53,10.67 40.74,10.67 38.83,10.67 36.8,10.67 36.7,10.77 C13.+ | IC10.P$5 62.71,14.86 65.12,12.45 | 65.12,12.45 65.92,12.45 65.92,12.32 | v64.15,11.48 65.12,12.45 | 62.58,16.23 62.58,19.05 62.58,20.95 C19.1
  Bottom 0.305: v39.08,7.62 v39.08,10.92
  Bottom 0.406: v68.42,22.86 67.41,23.88 v67.41,26.8 64.05,26.8 v61.69,29.29
  Bottom 0.61: v71.09,9.65 v76.04,12.57
  Bottom 0.813: v44.04,11.18 51.3,11.18 51.61,11.48 v64.15,11.48
+3V3S
  Top 0.406: IC4.P$5 40.1,54.1 39.59,54.61 34.26,54.61 32.73,53.09 C22.1 32.99,52.95 32.99,51.31 | R52.1 44.58,44.2 R51.1 44.58,44.45 44.67,44.7 43.25,46.13 C2.+ | 32.99,51.31 R55.1 | IC3.8 32.99,51.31
  Top 0.61: C2.+ 41.62,46.48 40.27,47.74 C23.2 40.1,48.43 IC4.P$5
+5V  (via drill 0.6)
  Top 0.61: IC2.20 52.55,30.99 51.91,31.62 v45.31,31.62 43.02,31.62 40.1,34.54 v40.1,45.97 | v43.91,47.24 44.16,47.27 C9.+ | SP.3 21.4,13.72 C11.+ 25.47,13.97 31.84,13.97 33.24,15.37 v33.24,20.45
  Top 1.27: C9.+ 46.32,47.88 46.32,51.94 47.31,52.81 C18.1 47.59,53.34 47.59,54.86 49.88,57.15 IC7.2
  Bottom 0.61: v40.1,45.97 41.37,47.24 v43.91,47.24 | v45.31,31.62 41.62,27.94 38.58,27.94 37.56,26.92 37.56,24.77 v33.24,20.45
+12V  (1 unrouted)
  Top 0.305: 76.93,3.3 77.69,2.54 77.69,1.52 78.2,1.02 94.2,1.02 98.01,4.83 U2.4
  Top 0.406: 67.09,4.45 73.25,4.45 74.39,3.3 76.93,3.3
  Top 0.813: R46.1 67.09,4.45
  Top 1.778: U2.4 U1.4 | 87.98,41.02 88.03,40.84 | 87.98,41.02 87.98,45.16 U3.4 | U5.4 88.03,40.84 87.98,41.02 | D2.A 92.19,58.67
  pour Top: 91.92,60.83 99.54,60.83 99.79,14.35 92.04,16.38
ACK  (via drill 0.6)
  Top 0.61: IC4.P$3 41.62,59.44 42.26,60.07 51.66,60.07 52.29,59.44 52.29,58.55 | v52.04,46.99 52.04,47.22 C27.+
  Top 1.016: Q10.4 Q10.2
  Top 1.27: Q10.4 61.06,56.39 58.52,58.93 55.75,58.93 C12.+ 53.18,58.96 | 53.18,58.96 52.7,58.96 52.29,58.55 IC7.3 | 53.18,58.96 53.31,58.83 C26.1 53.34,53.57 53.31,49.15 C27.+
  Bottom 0.61: v52.04,46.99 48.48,46.99 38.32,36.58 38.2,36.45 38.2,32.89 38.18,32.79 | C25.1 38.13,32.58 38.18,32.79 | U$1.6 38.15,34.04 38.18,32.79
AUX  (via drill 0.6, 1 pad 2.18)
  Top 0.305: 81.81,40.64 U5.1 | R41.2 79.13,31.33 v79.09,31.37
  Top 1.27: v79.22,41.27 79.34,41.27 79.98,40.64 81.81,40.64
  Bottom 0.305: v79.09,31.37 78.96,31.5 78.96,41.15 v79.22,41.27
  Bottom 1.778: D5.C 85.73,40.22 85.31,40.64 79.85,40.64 v79.22,41.27
CAF_RPS_INPUT  (via drill 0.6)
  Top 0.305: R65.1 54.2,7.87 v53.18,8.89
CAN-BUS_HIGH
  Top 0.406: IC9.7 80.17,17.46 82.01,15.62 83.53,15.62 84.93,17.02 84.93,24.89 86.2,26.16 90.65,26.16 91.28,25.53 92.24,25.53 J2.A3
CAN-BUS_LOW
  Top 0.406: IC9.6 81.44,17.2 82.14,16.51 83.28,16.51 83.92,17.14 83.92,25.27 85.82,27.18 90.65,27.18 91.41,28.07 92.24,28.07 J2.A4
CAN_INT
  Top 0.305: IC1.18 56.28,14.28 56.86,14.86 56.86,19.56 57.5,20.19 57.5,22.23 58.13,22.86 63.72,22.86 64.87,21.72 IC8.12
CBR  (via drill 0.6)
  Top 0.305: v51.61,15.62 51.28,15.62 45.31,21.59 45.31,22.1 44.99,22.42 IC1.48 | v64.36,15.37 IC8.17
  Bottom 0.305: v51.61,15.62 51.66,15.62 51.91,15.37 v64.36,15.37
CC  (2 unrouted)
  Top 2.54: D1.A2 20.16,39.24 21.3,38.1 21.3,36.83 Q11.D
  Bottom 0.305: R60.2 23.08,33.53 21.43,35.18 Q11.D
CF  (1 unrouted)
  Top 0.305: R59.1 27.95,22.31 28.29,21.84 Q9.D
  Top 0.61: C35.2 14.2,27.56 D1.A1
  Bottom 2.54: D1.A1 13.68,28.19 14.57,27.3 23.97,27.3 28.29,22.99 Q9.D
CP
  Top 0.406: R38.1 92.3,21.17 92.26,20.45
  Top 1.778: J2.A1 92.26,20.45 92.26,16.29 U1.1
  Bottom 1.778: D6.C 92.26,13.97 J2.A1
DP  (via drill 0.6)  (1 unrouted)
  Top 0.406: U3.1 79.2,47.78 R37.2
  Top 1.27: 85.57,48.46 83.86,48.46 83.28,47.88 81.93,47.88 U3.1
  Top 1.422: 85.57,48.46 v86.07,48.46
  Bottom 1.778: D3.C 86.24,48.29 v86.07,48.46
GKPH  (1 unrouted)
  Top 1.778: 11.68,57.94 11.3,58.19 11.34,58.28
  Top 2.54: IC5.1 11.68,57.94 | IC5.5 20,59.05 12.92,59.05 11.3,58.19
  Bottom 1.27: 12.79,59.05 12.41,57.2 IC5.1
  Bottom 2.54: 23.46,56.39 20.03,59.05 12.79,59.05 11.46,58.36 | 11.2,58.42 IC5.1
GKZ  (1 unrouted)
  Top 0.305: R36.2 24.23,46.1 23.34,46.99
  Top 1.778: 23.36,46.97 IC6.5
  Top 2.54: 23.36,46.97 23.34,46.99 20.03,49.66 12.92,49.66 10.89,48.26 10.89,48.19 IC6.1
  Bottom 2.54: 13.05,46.99 11.46,47.82 10.95,48.2 10.95,48.12 IC6.1
GND  (via drill 0.5, 0.6, 1)  (1 unrouted)
  Top 0.254: 71.47,35.31 73.12,35.31 | 59.15,35.05 60.93,35.05 60.93,34.02 Q8.2
  Top 0.305: 74.01,32.77 73.25,33.53 73.25,34.14 Q5.2 | IC1.63 40.66,14.28 | 40.84,14.78 43.12,14.78 IC1.62 | R15.1 55.47,32.13 54.83,32.77 v54.07,32.77
  Top 0.406: IC3.4 36.8,40.26 37.56,39.24 37.56,38.65 R33.1
  Top 0.61: IC10.P$2 59.66,7.75 58.9,6.99 58.9,6.62 C17.2
  Top 0.813: R2.2 26.38,42.93 v27.65,44.2
  other vias: 89.38,13.72 88.61,5.08 86.58,2.29 79.98,5.46 93.95,9.53 95.85,9.53 80.11,14.1 77.31,16.76 75.53,25.65 83.92,27.18 51.91,52.58 50.9,50.8 49.12,50.8 57.25,53.98 23.34,9.91 59.02,21.46 67.66,7.49 56.74,2.79 56.74,4.19 67.66,17.91 72.36,19.81 72.48,40.26 67.02,51.94 60.67,40.26 73.37,1.4 69.18,1.4 65.12,1.27 11.27,1.4 23.84,1.4 17.11,35.81 36.42,16.26 18.26,23.37 43.28,54.61 57.5,48.39 58.26,46.1 85.31,35.56 54.07,39.5 48.36,49.02 53.82,46.1 37.69,51.82 37.69,49.02 35.4,56.13 31.21,54.99 24.35,50.29 6.95,35.43 1.75,34.92 1.75,31.75 1.75,40.39 1.75,41.91 1.75,36.45 20.41,33.27 87.98,31.62 83.92,45.34 23.21,19.81 51.28,32.77 51.53,37.08 60.17,24.13 69.44,40.26 47.21,14.48 84.68,42.93 83.66,53.59 27.27,27.81 64.99,35.31 63.6,29.21 51.28,27.64 55.09,36.07 36.29,43.94 39.47,12.45 32.15,12.47 64.23,7.62 65.12,4.32 79.85,49.28 76.04,46.23 28.92,38.73 59.02,53.98 43.02,43.94 25.11,58.8 35.02,59.56 37.56,18.8 29.69,27.81 33.5,27.81 24.1,23.24 30.19,12.57 28.42,12.57 1.49,7.11 1.49,12.95 1.49,19.56 1.49,25.91 83.79,38.99 80.99,51.82 89.38,16.26 33.37,33.4 27.15,33.66 46.07,33.53 40.35,32.38 73.25,32 61.69,12.65 67.41,12.65 61.06,32.51 57.5,25.91 53.56,23.5 72.99,43.31 76.3,41.78
  pour Top: 20.8,60.83 90.9,60.83 91.28,15.62 99.79,13.46 99.66,0.25 0.22,0.25 0.22,43.94 6.57,43.94 6.83,41.4 13.3,41.4 20.8,43.94
  pour Bottom: 20.34,60.86 99.74,60.86 99.74,0.23 0.27,0.23 0.35,44.2 6.19,44.2 9.49,31.75 16.22,31.5 16.22,36.45 20.08,40.01
GNDA  (4 unrouted)
MCLK  (via drill 0.6)
  Top 0.305: v64.36,20.45 IC8.13 | IC1.47 45.49,24.2 45.18,24.51 44.42,24.51 44.04,24.13 v44.04,24
  Bottom 0.305: v64.36,20.45 63.6,20.45 63.21,20.07 51.53,20.07 47.59,24 v44.04,24
MI  (via drill 0.6)
  Top 0.305: v64.36,17.91 IC8.15 | v51.53,17.91 49.75,17.91 45.99,21.67 IC1.46
  Bottom 0.305: v51.53,17.91 v64.36,17.91
MO  (via drill 0.6)
  Top 0.305: IC1.45 46.49,21.93 47.97,20.45 v49.24,20.45 | v64.36,19.18 IC8.14
  Bottom 0.305: v49.24,20.45 50.51,19.18 v64.36,19.18
N$1
  Top 0.406: IC8.1 77.35,14.1 IC9.1
N$2
  Top 0.406: IC6.4 23.56,43.11 | 23.56,43.11 R2.1 | R28.2 23.63,41.77 23.56,43.11
N$3
  Top 0.406: R3.2 29.77,59.52 Q1.3
N$4
  Top 0.406: R4.2 27.61,39.88 Q2.3
N$5
  Top 0.305: IC1.43 47.49,24.24 46.58,25.15 44.42,25.15 40.99,28.57 40.99,29.26 IC2.11
N$6
  Top 0.406: IC5.2 17.8,52.51 19.91,54.61 22.07,54.61 22.83,53.85 24.19,53.85 R3.1
N$7
  Top 0.305: IC1.9 48.99,7.37 X2.1 C4.2
N$8
  Top 0.305: R30.2 28.92,9.4 26.64,7.11 26.64,5.46 JTAG.2
N$9
  Top 0.305: R31.2 29.47,7.66 29.18,7.37 29.18,5.46 JTAG.4
N$10
  Top 0.406: 26.42,53.72 R27.2 | 26.42,53.72 R1.1 | IC5.4 26.48,52.51 26.42,53.72
N$11
  Top 0.305: IC1.42 47.99,24.5 46.58,25.91 44.93,25.91 42.39,28.45 IC2.12
N$12
  Top 0.305: IC1.41 48.49,24.76 46.7,26.54 45.56,26.54 43.66,28.45 IC2.13
N$13
  Top 0.305: IC1.40 48.99,25.02 46.83,27.18 46.2,27.18 44.93,28.45 IC2.14
N$14
  Top 0.406: Q2.1 26.7,37.18 R26.2
N$15
  Top 0.406: IC6.2 18.2,43.11 20.16,41.15 22.07,41.15 23.59,39.62 R4.1
N$16
  Top 0.406: Q1.1 35.81,57.72 R24.2
N$17
  Top 0.305: Q4.B 70.97,29.13 R5.2
N$18
  Top 0.305: SP.1 16.8,8.64 R11.1
N$19
  Top 0.305: Q4.C 71.13,31.71 70.71,32.13 R6.2 R7.1
N$20
  Top 0.305: R7.2 67.83,34.71 68.42,35.31 70.2,35.31 70.96,34.54 71.22,34.27 Q5.1
N$21
  Top 0.406: C23.1 43.4,48.51 44.67,49.78 IC4.P$8
N$22
  Top 0.305: R9.1 75.19,35.01 75.15,35.05 76.8,35.05 78.33,33.53 78.33,32.42 R8.1 77.15,31.07 D14.C 74.44,30.61 69.95,30.61 69.31,29.97 R63.1
N$23
  Top 0.305: IC1.39 49.49,25.29 46.2,28.57 IC2.15
N$24
  Top 0.305: IC1.38 49.99,25.55 47.47,28.07 IC2.16
N$25
  Top 0.305: R58.1 57.23,6.99 LED.A
N$26
  Top 0.305: IC1.8 48.49,7.37 X2.2 C3.2
N$27
  Top 0.305: R14.2 58.01,29.34 58.13,29.21 58.84,29.21 Q6.B
N$28
  Top 0.305: R16.1 R15.2 57.75,32.13 58.26,31.62 59.57,31.62 Q6.C
N$29
  Top 0.305: IC1.10 49.49,8.9 52.55,5.84 C5.2
N$30
  Top 0.305: IC1.11 49.99,9.29 53.31,5.97 53.31,5.33 54.32,4.41 C6.2
N$31
  Top 0.305: IC1.7 47.99,8.52 45.18,5.71 C7.2
N$32
  Top 0.305: IC1.17 54.54,12.49 R64.2
N$33
  Top 0.305: R16.2 55.51,34.46 55.98,34.92 57.99,34.92 Q8.1
N$34
  Top 0.305: IC1.37 50.49,25.81 48.74,27.56 48.74,28.45 IC2.17
N$35
  Top 0.305: 36.04,48.77 C36.2
  Top 0.406: IC3.6 35.53,48.13 35.78,48.39 36.04,48.77 36.04,50.63 R34.1 R35.2
N$36
  Top 0.305: IC1.36 50.99,26.07 50.01,27.05 IC2.18
N$37
  Bottom 0.406: 30.96,35.31 25.11,35.31 Q11.G | 30.96,35.31 U$1.7 | R56.1 31.14,35.12 30.96,35.31
N$38
  Top 0.406: Q9.G 30.83,17.33 R57.1
  Bottom 0.406: U$1.5 36.54,32.77 36.54,25.15 33.75,22.35 31.72,22.35 30.83,21.46 Q9.G
N$39
  Top 0.406: Q13.1 59.02,52.26 R25.1
N$40
  Top 0.305: IC3.2 34.26,40.13 34.51,39.88 34.51,39.54 R32.1 34.35,38.61 | C37.2 34.35,38.61 | 34.35,38.61 R33.2
N$41
  Top 0.305: R55.2 29.78,50.42 | 30.5,45.93 C8.1 | 30.5,44.07 30.62,43.94
  Top 0.406: IC3.3 35.53,42.42 34,43.94 30.62,43.94 | C8.1 30.43,48.21 L3.1 30.25,50.64 R55.2 | D13.C 30.5,44.07 30.5,45.93
N$42
  Top 0.406: R22.2 68.84,54.08 Q10.1 66.87,54.08 64.1,51.31 Q13.3
N$43  (via drill 0.6)
  Top 0.305: IC3.1 32.99,40.39 32.73,40.13 32.73,39.46 R32.2 C37.1
  Top 0.406: IC3.5 37.89,46.81 v37.94,46.86 | v31.97,41.5 32.94,41.53 IC3.1
  Bottom 0.406: v37.94,46.86 37.33,46.84 v31.97,41.5
N$44
  Top 0.305: R36.1 25.96,46.75 L3.2
N$45
  Top 0.305: IC1.61 41.33,15.28 39.47,17.02 R21.2
N$46
  Top 0.305: IC1.60 41.72,15.78 40.86,16.64 R23.2
N$47  (via drill 0.6)
  Top 0.305: IC1.25 53.44,17.78 53.18,18.03 53.18,21.21 v53.05,21.59
  Bottom 0.305: v53.05,21.59 49.75,24.89 49.75,25.61 R40.2
N$48
  Top 0.406: IC8.2 81.12,15.37 82.77,13.72 82.77,12.6 IC9.4
N$49
  Top 0.406: IC8.8 77.78,22.99 C33.2 78.78,23.03 X3.3
N$50  (via drill 0.6)
  Top 0.305: IC1.24 53.18,17.28 52.67,17.78 52.67,20.45 v51.78,21.34
  Bottom 0.305: R42.2 48.57,24.55 v51.78,21.34
N$51  (via drill 0.6)
  Top 0.305: IC1.23 55.61,16.78 55.85,17.02 55.85,20.19 56.36,20.7 56.36,23.5 58.77,25.91 71.09,25.91 73.76,28.57 77.06,28.57 v77.95,29.46 | v77.69,44.58 77.69,45.21 78.2,45.72 78.29,45.72 R43.2
  Bottom 0.305: v77.95,29.46 77.95,39.75 77.56,40.13 77.56,42.42 77.95,42.8 77.95,43.94 v77.69,44.58
N$52
  Top 0.305: R54.2 78.58,28.57 77.95,27.94 74.01,27.94 71.47,25.4 59.02,25.4 56.86,23.24 56.86,20.45 56.36,19.94 56.36,16.76 55.87,16.28 IC1.22
N$53  (via drill 0.6)
  Top 0.305: R61.2 76.42,10.16 v71.6,14.99 | IC1.21 53.34,15.78 51.91,14.35 v51.91,14.48
  Bottom 0.305: v71.6,14.99 70.71,14.1 66.26,14.1 65.88,13.72 63.09,13.72 62.71,14.1 52.04,14.1 v51.91,14.48
N$54  (via drill 0.6)
  Top 0.305: R62.2 75.28,6.99 v69.56,12.7 | IC1.20 53.6,15.28 52.93,14.61 v52.93,13.21
  Bottom 0.305: v69.56,12.7 68.67,13.59 66.64,13.59 66.14,13.08 62.83,13.08 62.33,13.59 53.31,13.59 v52.93,13.21
N$55
  Top 0.305: R65.2 56.06,9.31 D16.C 56.05,9.4 55.09,9.4 54.45,10.03 R64.1
N$57
  Top 0.305: IC10.P$8 58.13,18.76 C28.1
N$58
  Top 1.016: 70.45,58.67 67.35,58.67 Q10.3
  Top 1.27: R22.1 70.07,58.29 70.45,58.67 | R45.1 70.2,49.4 71.6,50.8 71.98,51.18 C10.1
  Top 1.778: 70.45,58.67 72.36,58.67 73.86,57.17 L1.2 73.86,53.57 C10.1
N$59
  Top 0.61: IC10.P$3 61.18,8.76 61.17,8.62 C17.1 61.55,5.97 71.16,5.97 C15.+ | L2.2 79.03,3.23 77.44,4.83 76.17,4.83 R44.1
  Top 0.813: C15.+ 72.93,6.67 74.52,5.08 75.91,5.08 R44.1
N$60
  Top 0.406: IC8.7 77.65,21.72 C32.2 81.05,21.55 X3.1
N$69
  Top 0.305: IC1.15 51.99,8.31 53.82,6.48 R58.2
NET$22
  Top 0.305: R18.1 65.63,36.7 66.26,36.07 66.26,32.51 65.88,32.13 65.33,32.13 R17.1 63.43,32.04 D15.C 62.83,31.5 61.94,31.5 61.06,30.61 57.63,30.61 57.33,30.35 R29.1
P_ACK  (via drill 0.6)
  Top 0.305: IC1.31 55.42,20.78 55.72,21.08 55.72,22.23 55.47,22.48 v55.47,23.24 | v51.86,26.34 53.31,27.81 53.31,31.37 52.55,32.13
  Top 0.406: 52.55,32.13 52.55,35.56 55.59,38.61 v55.59,40.51 | v55.59,48.51 55.59,49.28 55.34,49.53 55.34,50.48 R25.2
  Bottom 0.305: v55.47,23.24 55.47,23.5 52.7,26.26 v51.86,26.34
  Bottom 0.406: v55.59,40.51 v55.59,48.51
RST/NMI  (via drill 0.6)
  Top 0.305: IC1.58 44.03,16.78 44.67,16.13 v44.67,15.11 44.67,13.97 42.77,12.06 R13.1
  Bottom 0.305: JTAG.11 39.21,2.92 40.48,4.19 40.48,10.92 v44.67,15.11
RX0
  Top 0.305: IC1.33 52.49,23.94 56.86,28.19 65.63,28.19 66.14,28.7 66.14,29.32 C39.2 66.78,29.97 R63.2
RX1
  Top 0.305: IC1.35 51.49,24.44 54.07,27.03 54.07,30.21 C38.2 54.21,30.35 55.12,30.35 R29.2
S_AUX
  Top 0.305: R54.1 80.83,28.79 80.87,28.83 80.87,30.06 R41.1 81.33,30.1 D10.C
S_CC  (via drill 0.6)
  Top 0.254: v36.29,21.97 36.29,27.18 v35.53,27.94
  Bottom 0.254: 45.43,25.65 43.4,25.65 42.13,24.38 42.13,22.48 41.62,21.97 v36.29,21.97 | v35.53,27.94 35.53,28.32 35.91,28.7 35.91,30.99 35.4,31.5 29.61,31.5 D8.C
  Bottom 0.305: R60.1 24.91,33.53 27.91,30.61 D8.C | 45.43,25.65 45.73,25.65 R40.1
S_CF  (via drill 0.6)
  Top 0.254: v35.78,20.83 33.75,22.86 R59.2
  Top 0.305: D7.C 28.63,24.77 28.66,24.77 29.18,24.26 29.18,24.13 29.69,23.62 29.69,22.9 R59.2
  Bottom 0.254: 45.69,25.15 43.66,25.15 42.64,24.13 42.64,22.23 41.88,21.46 37.05,21.46 36.42,20.83 v35.78,20.83
  Bottom 0.305: 45.69,25.15 R42.1
S_CP  (via drill 0.6)
  Top 0.305: v88.49,18.16 R38.2 | R61.1 82.14,10.16 v84.17,12.19
  Bottom 0.305: v88.49,18.16 86.89,16.56 D11.C 84.17,14.02 v84.17,12.19
S_DP
  Top 0.305: R37.1 77.69,47.88 77.56,47.75 77.56,46.65 | 77.56,46.65 R43.1 | 77.56,46.65 77.44,45.9 D9.C
  Top 0.406: R37.1 77.56,47.84
S_VF  (via drill 0.6)
  Top 0.305: R62.1 82.77,6.99 83.03,7.24 v83.46,7.24 84.07,6.75 84.07,6.07 84.17,5.97 D12.C | v88.74,9.53 R39.2
  Bottom 0.305: v88.74,9.53 86.38,9.53 86.33,9.53 84.04,7.24 v83.46,7.24
SENSE_FD  (via drill 0.6)
  Top 0.305: IC3.7 34.26,45.85 35.02,45.09 37.05,45.09 38.7,43.43 38.7,28.32 39.21,27.81 39.21,20.57 v38.83,20.19 | 34.26,49.28 C36.1 | v41.24,20.57 41.88,19.94 41.88,16.38 41.99,16.28 IC1.59
  Top 0.406: IC3.7 34.26,49.28 34.26,49.62 R34.2
  Bottom 0.305: v41.24,20.57 40.35,20.57 39.97,20.19 v38.83,20.19
SENSE_GKPH
  Top 0.305: IC1.2 45.49,10.85 44.55,9.91 36.16,9.91 35.27,10.79 35.27,17.65 | 35.27,17.65 35.27,18.16 38.58,21.46 38.58,27.69 38.07,28.19 38.07,35.05 36.04,37.08 31.72,37.08 31.21,37.59 31.21,39.24 29.05,41.27 29.05,49.66 28.16,50.55 28.16,52.54 R27.1 | C41.1 35.4,17.53 35.27,17.65
SENSE_GKZ
  Top 0.305: IC1.3 45.99,10.66 44.62,9.3 35.91,9.27 34.64,10.54 34.64,11.05 | 34.64,11.05 34.64,18.29 38.07,21.72 38.07,27.43 37.43,28.07 37.43,34.42 35.53,36.32 31.21,36.32 30.19,37.34 30.19,39.12 28.67,40.64 26.38,40.64 | C40.1 34.58,11.47 34.58,11.11 34.64,11.05
  Top 0.406: 26.38,40.64 R28.1
SENSE_P
  Top 0.305: IC1.4 46.49,10.32 44.67,8.51 34.64,8.51 31.72,11.3 28.04,11.3 24.16,7.55 23.29,7.55 C21.1 21.07,5.59 20.03,5.59 20.23,5.53 R12.1 R11.2
STE  (via drill 0.6)
  Top 0.305: v64.36,16.64 IC8.16 | v48.23,21.72 47.47,21.72 46.99,22.2 IC1.44
  Bottom 0.305: v64.36,16.64 51.15,16.64 48.23,19.56 v48.23,21.72
T_AUX
  Top 0.406: U5.3 81.81,36.07 79.85,36.07 74.26,41.66 52.42,41.66 51.28,40.51 IC2.2
T_CC  (via drill 0.6)
  Top 0.305: v44.93,35.56 IC2.7
  Bottom 0.305: v44.93,35.56 44.67,35.31 U$1.2
T_CF  (via drill 0.6)
  Top 0.305: v44.42,33.78 44.42,34.04 43.66,34.8 IC2.8
  Bottom 0.305: U$1.4 43.4,32.77 v44.42,33.78
T_CP  (via drill 0.6)
  Top 0.305: v88.61,11.56 88.64,11.53
  Top 0.406: IC2.4 48.74,37.21 v51.02,34.92 | v70.71,22.61 70.71,14.22 75.91,9.02 82.77,9.02 v84.42,10.67 | 88.64,11.53 U1.3
  Bottom 0.406: v51.02,34.92 62.45,34.92 70.71,26.42 v70.71,22.61 | v88.61,11.56 85.31,11.56 v84.42,10.67
T_DP
  Top 0.406: IC2.3 50.01,40.64 51.66,42.29 74.64,42.29 75.53,43.18 81.81,43.18 U3.3
T_GKPH  (via drill 0.6)
  Top 0.305: IC1.13 50.99,14.44 50.26,15.11 50.26,15.88 44.75,21.39 44.75,21.77 43.02,23.5 43.02,25.27 39.34,28.96 39.34,44.96 39.08,45.21 39.08,52.58 38.83,52.83 v38.83,53.34
  Top 0.406: v38.32,59.44 36.76,59.44 R24.1
  Bottom 0.305: v38.83,53.34 38.83,58.93 v38.32,59.44
T_GKZ  (via drill 0.6)
  Top 0.305: IC1.12 50.49,14.12 49.75,14.86 49.75,15.62 44.16,21.21 44.16,21.46 42.77,22.86 v41.24,22.86 | v37.18,22.86 37.18,27.05 36.8,27.43 36.8,34.29 35.78,35.31 R26.1
  Bottom 0.305: v41.24,22.86 v37.18,22.86
T_VF  (via drill 0.6)
  Top 0.406: U2.3 88.64,2.52 85.95,5.21 85.95,6.48 84.3,8.13 75.53,8.13 69.56,14.22 v69.56,21.34 | v49.75,33.91 46.2,37.47 IC2.6
  Bottom 0.406: v69.56,21.34 69.56,26.29 62.2,33.91 v49.75,33.91
TCK  (via drill 0.6)
  Top 0.305: IC1.57 44.54,17.28 44.42,17.27 45.56,16.13 v45.94,16.13
  Bottom 0.305: JTAG.7 35.4,4.06 35.4,10.41 41.12,16.13 v45.94,16.13
TDI  (via drill 0.6)
  Top 0.305: IC1.55 44.91,18.28 v45.31,18.67
  Bottom 0.305: v45.31,18.67 45.05,18.67 44.93,18.54 41.75,18.54 30.32,7.24 30.32,4.06 JTAG.3
TDO/TDI  (via drill 0.6)
  Top 0.305: IC1.54 43.89,18.78 44.42,19.3 v44.42,19.56
  Bottom 0.305: v44.42,19.56 41.5,19.56 27.78,5.97 27.78,4.06 JTAG.1
TMS  (via drill 0.6)
  Top 0.305: IC1.56 45.57,17.78 v45.94,17.4
  Bottom 0.305: v45.94,17.4 41.5,17.4 32.86,8.76 32.86,4.06 JTAG.5
TP_
  Top 0.305: J2.A5 90.28,30.63 88.36,28.7 87.55,28.7 R53.1
TPROTECT  (via drill 0.6)
  Top 0.305: IC1.16 52.49,10.73 v53.05,10.16 | R53.2 83.8,28.72 81.88,26.8 75.03,26.8 73.63,25.4 v73.63,14.99
  Bottom 0.305: v53.05,10.16 68.93,10.16 68.93,10.29 v73.63,14.99
TSENSE_0  (via drill 0.6)  (2 unrouted)
  Top 0.305: v40.74,24.64 40.35,24.26 40.35,19.81 40.99,19.18 R23.1
  Top 0.406: 89.88,51.05 89.07,50.24 88.3,50.24 R49.1 | R49.1 86.35,50.46 | R49.1 C30.1 78.6,50.44 71.85,43.69 50.51,43.69 49.5,42.67 v49.24,42.67 46.83,42.67 46.58,42.8 R52.2
  Bottom 0.305: v40.74,24.64 41.62,24.64 47.97,30.99 47.97,39.88 49.24,41.15 v49.24,42.67
TSENSE_1  (via drill 0.6)  (2 unrouted)
  Top 0.305: v40.23,25.91 39.72,25.4 39.72,19.27 R21.1
  Top 0.406: 90.48,53.54 89.76,54.27 89.76,56.52 89.38,56.9 88.38,56.9 R50.1 C31.1 83.52,56.63 71.34,44.45 v48.23,44.45 47.72,44.45 47.59,44.32 R51.2
  Bottom 0.305: v40.23,25.91 42.13,25.91 47.47,31.24 47.47,40.13 48.23,40.89 v48.23,44.45
TSENSE_INTERN  (via drill 1)
  Top 0.305: IC1.5 46.99,9.93 43.66,6.6 38.58,6.6 37.94,5.97 37.94,4.57 37.43,4.06 24.35,4.06 | v22.7,3.3 23.34,3.3 24.1,4.06 24.35,4.06 | R20.2 24.23,4.19 24.35,4.06
TX0
  Top 0.305: IC1.32 54.54,23.96 56.61,25.91 56.61,26.29 57.5,27.05 66.14,27.05 67.15,28.07 R5.1
TX1
  Top 0.305: IC1.34 51.99,24.2 54.71,26.92 54.71,28.66 R14.1
VF  (via drill 0.6)
  Top 0.305: U2.1 91.99,8.65 R39.1
  Top 1.778: J2.A2 87.49,23.01 86.45,21.97 86.45,8.38 87.73,7.11 v90.14,7.11 91.97,7.11 U2.1
  Bottom 1.422: D4.C 90.99,6.01 v90.14,7.11
VGK  (via drill 1)  (1 unrouted)
  Top 0.61: C35.1 16.99,32.26
  Top 1.778: D1.C 16.99,32.26 C20.+ C24.+
  Bottom 1.27: 13.05,53.34 17.37,56.26 IC5.3
  Bottom 1.778: D1.C 22.07,29.97 C20.+
  other vias: 1.62,59.56 1.62,54.56 1.62,50.78 1.62,45.78 1.62,56.09 1.62,49.26
  pour Bottom: 0.1,60.96 19.78,60.96 19.53,40.39 15.46,36.58 15.46,32.26 10.13,32.51 6.7,44.83 0.1,44.83
  pour Top: 0.1,60.96 20.03,60.96 20.03,44.45 12.92,42.16 7.46,42.16 7.08,44.7 0.1,44.7
VSENSE_0
  Top 0.305: IC1.6 47.49,9.54 43.91,5.97 43.91,2.03 44.55,1.4 57.61,1.4 C29.1 60.93,2.56 R48.1 63.42,2.53 R47.1 R46.2
WBUS1
  Top 0.305: Q5.3 70.2,36.41 R10.1
  Top 0.406: Q5.3 72.57,36.41 73.63,37.47 75.15,37.47 | J2.A6 92.41,33.15 79.72,33.15 75.41,37.47 75.15,37.47 | R9.2 75.03,37.34 75.15,37.47
WBUS2
  Top 0.305: R18.2 62.07,36.7 61.56,36.2 60.55,36.2 59.96,36.2 Q8.3 58.52,36.15 R19.1
  Top 0.406: J2.A7 90.79,35.71 89.12,34.04 79.98,34.04 75.79,38.35 67.02,38.35 66.26,39.12 63.34,39.12 62.07,37.85 62.07,36.7

### Text on the board
Top: TOP
Bottom: BOT